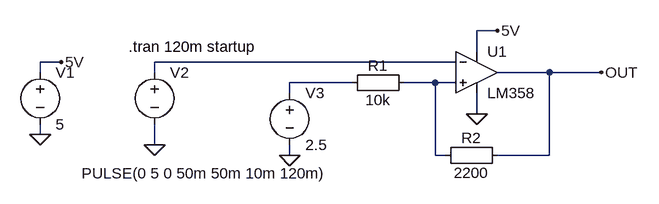
[diagram p0: schematic LM358 Schmitt Trigger V0.asc]
LM358 Schmitt Trigger V0.asc, the LTspice schematic file:
Version 4
SHEET 1 880 680
WIRE 112 96 80 96
WIRE 80 128 80 96
WIRE -560 144 -592 144
WIRE 48 144 -416 144
WIRE -592 160 -592 144
WIRE -416 160 -416 144
WIRE 192 160 112 160
WIRE 272 160 192 160
WIRE -112 176 -208 176
WIRE 16 176 -32 176
WIRE 48 176 16 176
WIRE -208 192 -208 176
WIRE 80 224 80 192
WIRE -592 256 -592 240
WIRE -416 272 -416 240
WIRE -208 288 -208 272
WIRE 16 288 16 176
WIRE 32 288 16 288
WIRE 192 288 192 160
WIRE 192 288 112 288
FLAG -560 144 5V
FLAG -592 256 0
FLAG 112 96 5V
FLAG 80 224 0
FLAG 272 160 OUT
FLAG -416 272 0
FLAG -208 288 0
SYMBOL OpAmp\\LM358 80 160 R0
SYMATTR InstName U1
SYMBOL voltage -592 144 R0
WINDOW 123 0 0 Left 0
WINDOW 39 0 0 Left 0
SYMATTR InstName V1
SYMATTR Value 5
SYMBOL Misc\\EuropeanResistor 128 272 R90
WINDOW 0 5 56 VBottom 2
WINDOW 3 27 56 VTop 2
SYMATTR InstName R2
SYMATTR Value 2200
SYMBOL Misc\\EuropeanResistor -16 160 R90
WINDOW 0 5 56 VBottom 2
WINDOW 3 27 56 VTop 2
SYMATTR InstName R1
SYMATTR Value 10k
SYMBOL voltage -416 144 R0
WINDOW 3 -112 172 Left 2
WINDOW 123 0 0 Left 0
WINDOW 39 0 0 Left 0
SYMATTR InstName V2
SYMATTR Value PULSE(0 5 0 50m 50m 10m 120m)
SYMBOL voltage -208 176 R0
WINDOW 123 0 0 Left 0
WINDOW 39 0 0 Left 0
SYMATTR InstName V3
SYMATTR Value 2.5
TEXT -456 120 Left 2 !.tran 120m startup

The netlist it stands for:
* LM358 Schmitt Trigger V0.asc
XU1 N003 N001 5V 0 OUT LM358  ; pins In+ In- V+ V- OUT
V1 5V 0 5
R2 OUT N003 2200
R1 N003 N002 10k
V2 N001 0 PULSE(0 5 0 50m 50m 10m 120m)
V3 N002 0 2.5
.tran 120m startup
.backanno
.end